# EAGLE design LaundryMote (EAGLE 6.5.0)
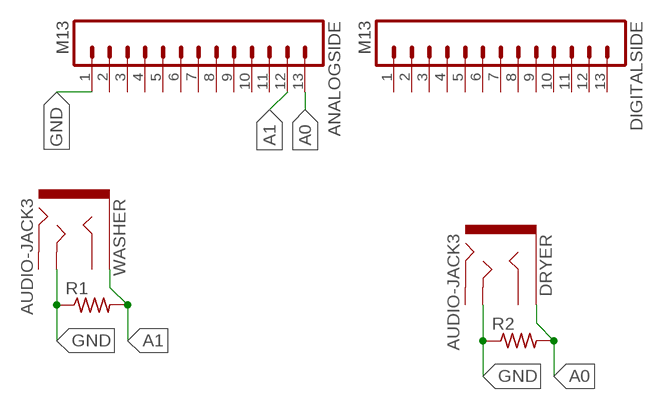
[diagram p0: schematic, sheet 1]

## Parts
ANALOGSIDE  M13  [1X13]
DIGITALSIDE  M13  [1X13]
DRYER  AUDIO-JACK3  [AUDIO-JACK-TRRS-SMD]
R1  R-US_0207/7  [0207/7]
R2  R-US_0207/7  [0207/7]
WASHER  AUDIO-JACK3  [AUDIO-JACK-TRRS-SMD]

## Nets
A0: ANALOGSIDE.13 DRYER.EARTH R2.2
A1: ANALOGSIDE.12 R1.2 WASHER.EARTH
GND: ANALOGSIDE.1 DRYER.TIP R1.1 R2.1 WASHER.TIP
Unconnected: ANALOGSIDE.2 ANALOGSIDE.3 ANALOGSIDE.4 ANALOGSIDE.5 ANALOGSIDE.6 ANALOGSIDE.7 ANALOGSIDE.8 ANALOGSIDE.9 ANALOGSIDE.10 ANALOGSIDE.11 DIGITALSIDE.1 DIGITALSIDE.2 DIGITALSIDE.3 DIGITALSIDE.4 DIGITALSIDE.5 DIGITALSIDE.6 DIGITALSIDE.7 DIGITALSIDE.8 DIGITALSIDE.9 DIGITALSIDE.10 DIGITALSIDE.11 DIGITALSIDE.12 DIGITALSIDE.13 DRYER.RING1 DRYER.RING2 WASHER.RING1 WASHER.RING2

## Library data of the parts
ANALOGSIDE DIGITALSIDE = SparkFun-Connectors:M13: 13-pin single row .1" header; OC_NEWARK: unknown
DRYER WASHER = SparkFun-Connectors:AUDIO-JACK3: Audio jack - 3.5mm TRRS variety - two rings.; OC_NEWARK: unknown
R1 R2 = adafruit:R-US_: RESISTOR, American symbol

## Board
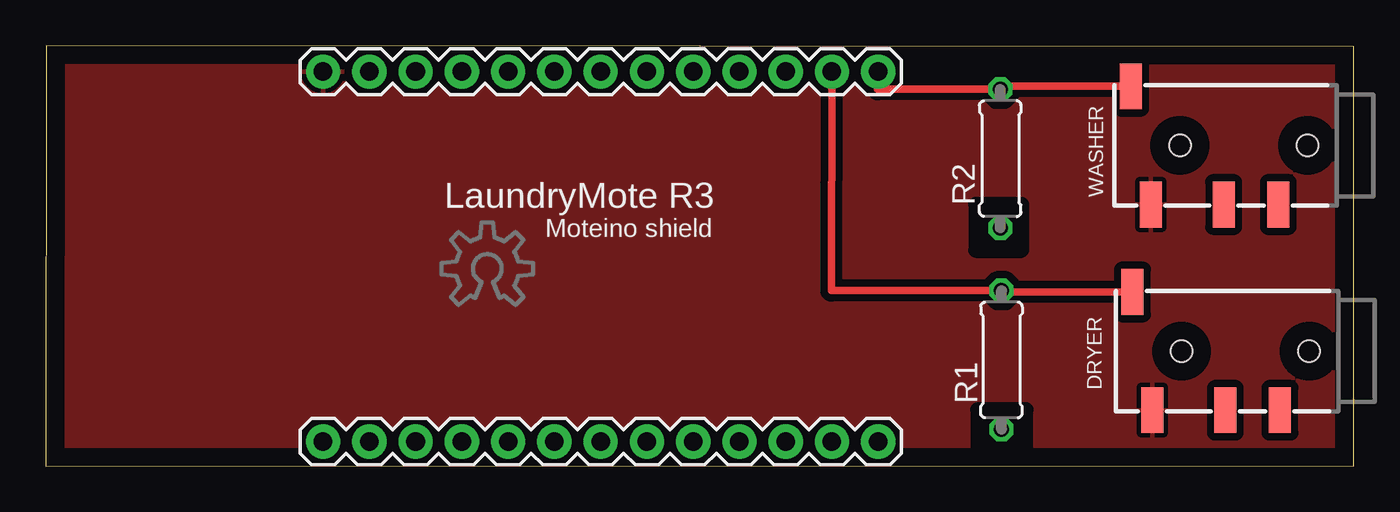
[diagram p1: board, top side]
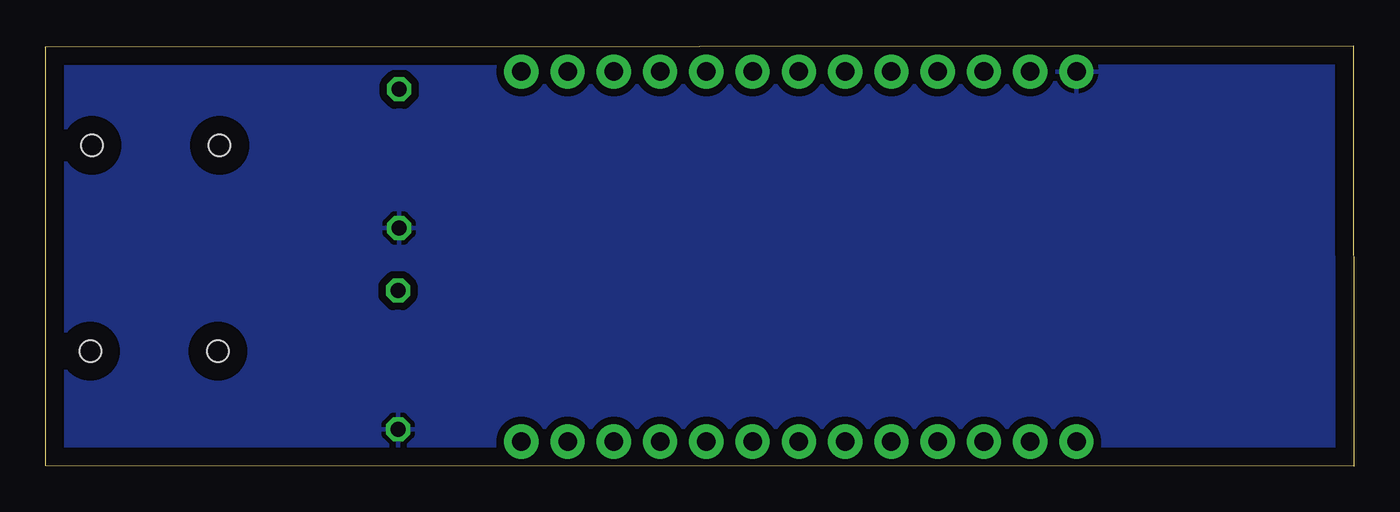
[diagram p2: board, bottom side, seen from below]

Size 71.84 x 23.13 mm. Coordinates in mm from the lower left corner, seen from the top.
Outline: 0,0 71.84,0.03 71.84,23.06 0.03,23.13 0,0
Copper layers (1*16): Top 0.035mm / dielectric 1.5mm / Bottom 0.035mm
Design rules "default": minimum track width 10mil, minimum drill 24mil, track to track 8mil, track to pad 8mil, pad to pad 8mil, via to via 8mil, smd to smd 8mil, copper to edge 40mil, drill to drill 8mil, minimum pad ring 10mil, minimum via ring 8mil, stop-mask expansion 4mil, vias tented up to drill 0mil, thermal gap 10mil
tRestrict: area 51.2,0.9 to 53.8,3.1; area 51.1,11.9 to 53.6,14.4

### Footprints (pad centres in the part's own frame; a part is rotated, then mirrored left to right if it is on the bottom)
1X13 = drill 1.016 pad 1.88: 1 0,0; 2 2.54,0; 3 5.08,0; 4 7.62,0; 5 10.16,0; 6 12.7,0; 7 15.24,0; 8 17.78,0; 9 20.32,0; 10 22.86,0; 11 25.4,0; 12 27.94,0; 13 30.48,0
AUDIO-JACK-TRRS-SMD = smd 1.2 x 2.5: EARTH 11.3,-3.25; RING1 6.2,3.25; RING2 3.2,3.25; TIP 10.2,3.25 | hole 1.2: 1.6,0; 8.6,0
0207/7 = drill 0.813 octagon: 1 -3.81,0; 2 3.81,0

### Placement (x,y rotation side)
ANALOGSIDE  15.24,21.69 0 top
DIGITALSIDE  15.24,1.37 0 top
DRYER  70.89,17.64 180 top
E$1  [OSHWLOGO_TOL_0.2]  24.26,10.87 0 top
R1  52.49,5.85 90 top
R2  52.43,16.92 90 top
WASHER  70.98,6.34 180 top

### Tracks (layer width: path | path; a pad name or v marks a point on that pad's centre or on a via)
A0
  Top 0.406: DRYER.EARTH 52.43,20.89 R2.2 45.68,20.73 ANALOGSIDE.13
A1
  Top 0.406: WASHER.EARTH 52.49,9.59 R1.2 43.14,9.66 ANALOGSIDE.12
GND
  pour Top (isolate 0.406): -1.09,24.75 -0.94,-1.38 76.56,-0.65 77.94,24.71
  pour Bottom (isolate 0.406): -0.64,23.83 -0.53,-0.86 76.56,-0.64 77.42,24.4

### Text on the board
tNames: WASHER | LaundryMote R3 | Moteino shield | DRYER
tValues: A1 | A0